# Altium schematic sheet valveconn.SchDoc
size A; SheetNumber: 3; SheetTotal: 5
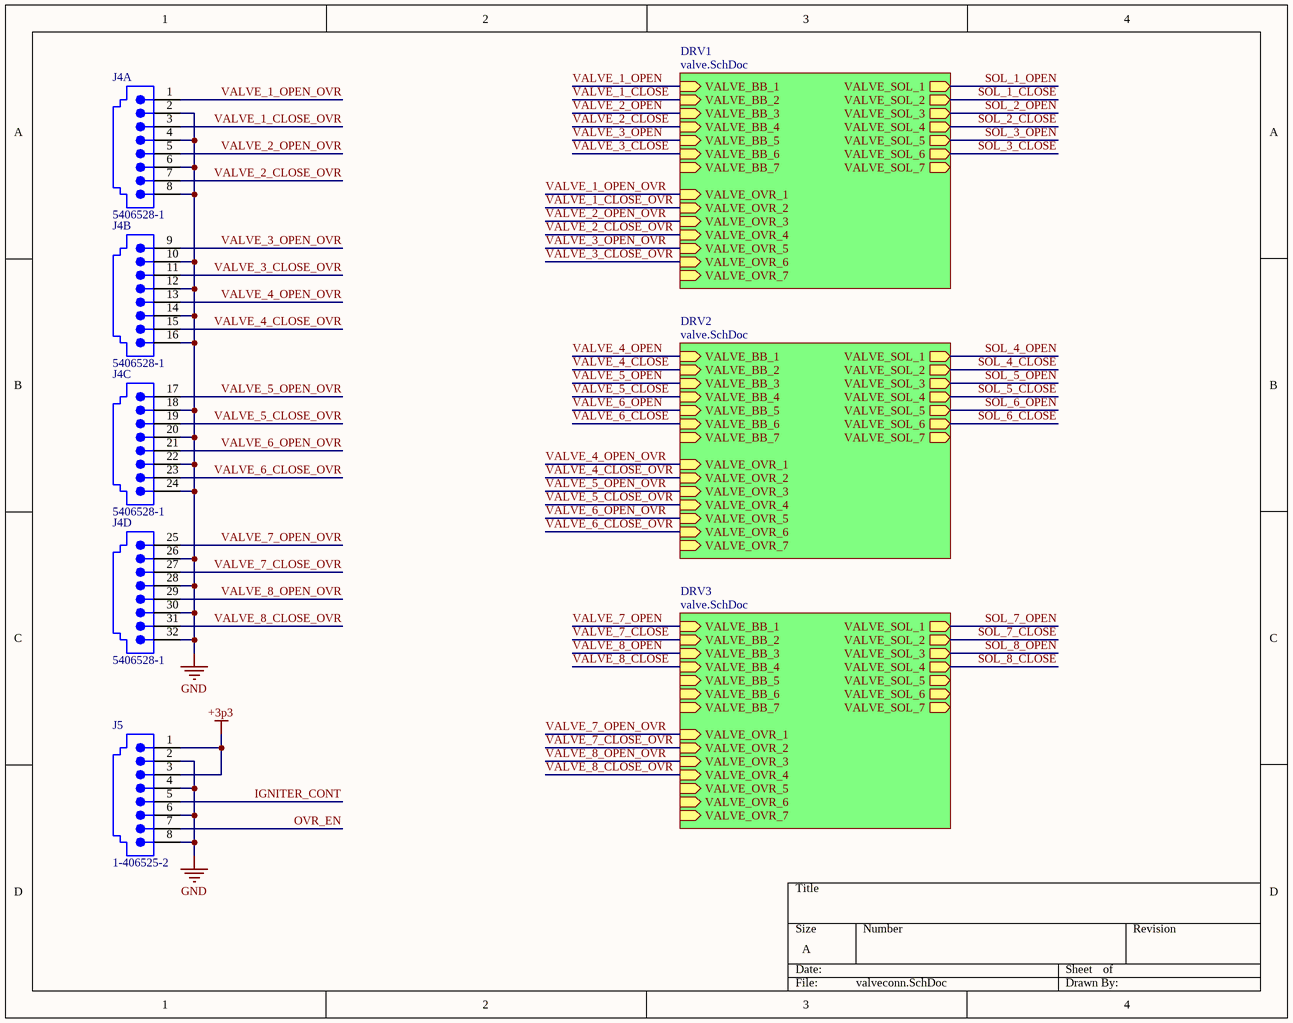
[diagram p0: valveconn.SchDoc]

## Parts
J4  5406528-1  [5406528-1]  (parts A,B,C,D of 4)
J5  1-406525-2  [1-406525-2]

## Sub-sheets
DRV1 = valve.SchDoc: VALVE_BB_7 (in), VALVE_OVR_4 (in), VALVE_BB_1 (in), VALVE_OVR_7 (in), VALVE_SOL_2 (out), VALVE_SOL_7 (out), VALVE_SOL_3 (out), VALVE_OVR_1 (in), VALVE_SOL_1 (out), VALVE_OVR_6 (in), VALVE_SOL_5 (out), VALVE_BB_2 (in), VALVE_BB_3 (in), VALVE_OVR_3 (in), VALVE_BB_4 (in), VALVE_OVR_5 (in), VALVE_SOL_4 (out), VALVE_BB_5 (in), VALVE_BB_6 (in), VALVE_SOL_6 (out), VALVE_OVR_2 (in)
DRV2 = valve.SchDoc: VALVE_BB_7 (in), VALVE_OVR_4 (in), VALVE_BB_1 (in), VALVE_OVR_7 (in), VALVE_SOL_2 (out), VALVE_SOL_7 (out), VALVE_SOL_3 (out), VALVE_OVR_1 (in), VALVE_SOL_1 (out), VALVE_OVR_6 (in), VALVE_SOL_5 (out), VALVE_BB_2 (in), VALVE_BB_3 (in), VALVE_OVR_3 (in), VALVE_BB_4 (in), VALVE_OVR_5 (in), VALVE_SOL_4 (out), VALVE_BB_5 (in), VALVE_BB_6 (in), VALVE_SOL_6 (out), VALVE_OVR_2 (in)
DRV3 = valve.SchDoc: VALVE_BB_7 (in), VALVE_OVR_4 (in), VALVE_BB_1 (in), VALVE_OVR_7 (in), VALVE_SOL_2 (out), VALVE_SOL_7 (out), VALVE_SOL_3 (out), VALVE_OVR_1 (in), VALVE_SOL_1 (out), VALVE_OVR_6 (in), VALVE_SOL_5 (out), VALVE_BB_2 (in), VALVE_BB_3 (in), VALVE_OVR_3 (in), VALVE_BB_4 (in), VALVE_OVR_5 (in), VALVE_SOL_4 (out), VALVE_BB_5 (in), VALVE_BB_6 (in), VALVE_SOL_6 (out), VALVE_OVR_2 (in)

## Nets
+3p3: J5.1 J5.3
GND: J4.2 J4.4 J4.6 J4.8 J4.10 J4.12 J4.14 J4.16 J4.18 J4.20 J4.22 J4.24 J4.26 J4.28 J4.30 J4.32 J5.2 J5.4 J5.6 J5.8
IGNITER_CONT: J5.5
OVR_EN: J5.7
SOL_1_CLOSE: sheet DRV1/VALVE_SOL_2
SOL_1_OPEN: sheet DRV1/VALVE_SOL_1
SOL_2_CLOSE: sheet DRV1/VALVE_SOL_4
SOL_2_OPEN: sheet DRV1/VALVE_SOL_3
SOL_3_CLOSE: sheet DRV1/VALVE_SOL_6
SOL_3_OPEN: sheet DRV1/VALVE_SOL_5
SOL_4_CLOSE: sheet DRV2/VALVE_SOL_2
SOL_4_OPEN: sheet DRV2/VALVE_SOL_1
SOL_5_CLOSE: sheet DRV2/VALVE_SOL_4
SOL_5_OPEN: sheet DRV2/VALVE_SOL_3
SOL_6_CLOSE: sheet DRV2/VALVE_SOL_6
SOL_6_OPEN: sheet DRV2/VALVE_SOL_5
SOL_7_CLOSE: sheet DRV3/VALVE_SOL_2
SOL_7_OPEN: sheet DRV3/VALVE_SOL_1
SOL_8_CLOSE: sheet DRV3/VALVE_SOL_4
SOL_8_OPEN: sheet DRV3/VALVE_SOL_3
VALVE_1_CLOSE: sheet DRV1/VALVE_BB_2
VALVE_1_CLOSE_OVR: J4.3 ; sheet DRV1/VALVE_OVR_2
VALVE_1_OPEN: sheet DRV1/VALVE_BB_1
VALVE_1_OPEN_OVR: J4.1 ; sheet DRV1/VALVE_OVR_1
VALVE_2_CLOSE: sheet DRV1/VALVE_BB_4
VALVE_2_CLOSE_OVR: J4.7 ; sheet DRV1/VALVE_OVR_4
VALVE_2_OPEN: sheet DRV1/VALVE_BB_3
VALVE_2_OPEN_OVR: J4.5 ; sheet DRV1/VALVE_OVR_3
VALVE_3_CLOSE: sheet DRV1/VALVE_BB_6
VALVE_3_CLOSE_OVR: J4.11 ; sheet DRV1/VALVE_OVR_6
VALVE_3_OPEN: sheet DRV1/VALVE_BB_5
VALVE_3_OPEN_OVR: J4.9 ; sheet DRV1/VALVE_OVR_5
VALVE_4_CLOSE: sheet DRV2/VALVE_BB_2
VALVE_4_CLOSE_OVR: J4.15 ; sheet DRV2/VALVE_OVR_2
VALVE_4_OPEN: sheet DRV2/VALVE_BB_1
VALVE_4_OPEN_OVR: J4.13 ; sheet DRV2/VALVE_OVR_1
VALVE_5_CLOSE: sheet DRV2/VALVE_BB_4
VALVE_5_CLOSE_OVR: J4.19 ; sheet DRV2/VALVE_OVR_4
VALVE_5_OPEN: sheet DRV2/VALVE_BB_3
VALVE_5_OPEN_OVR: J4.17 ; sheet DRV2/VALVE_OVR_3
VALVE_6_CLOSE: sheet DRV2/VALVE_BB_6
VALVE_6_CLOSE_OVR: J4.23 ; sheet DRV2/VALVE_OVR_6
VALVE_6_OPEN: sheet DRV2/VALVE_BB_5
VALVE_6_OPEN_OVR: J4.21 ; sheet DRV2/VALVE_OVR_5
VALVE_7_CLOSE: sheet DRV3/VALVE_BB_2
VALVE_7_CLOSE_OVR: J4.27 ; sheet DRV3/VALVE_OVR_2
VALVE_7_OPEN: sheet DRV3/VALVE_BB_1
VALVE_7_OPEN_OVR: J4.25 ; sheet DRV3/VALVE_OVR_1
VALVE_8_CLOSE: sheet DRV3/VALVE_BB_4
VALVE_8_CLOSE_OVR: J4.31 ; sheet DRV3/VALVE_OVR_4
VALVE_8_OPEN: sheet DRV3/VALVE_BB_3
VALVE_8_OPEN_OVR: J4.29 ; sheet DRV3/VALVE_OVR_3

## Library data of the parts
J4 = 5406528-1: 4 port RJ45
J5 = 1-406525-2: 1 port RJ45